# EAGLE schematic Power Board rev4 (EAGLE 8.4.1)
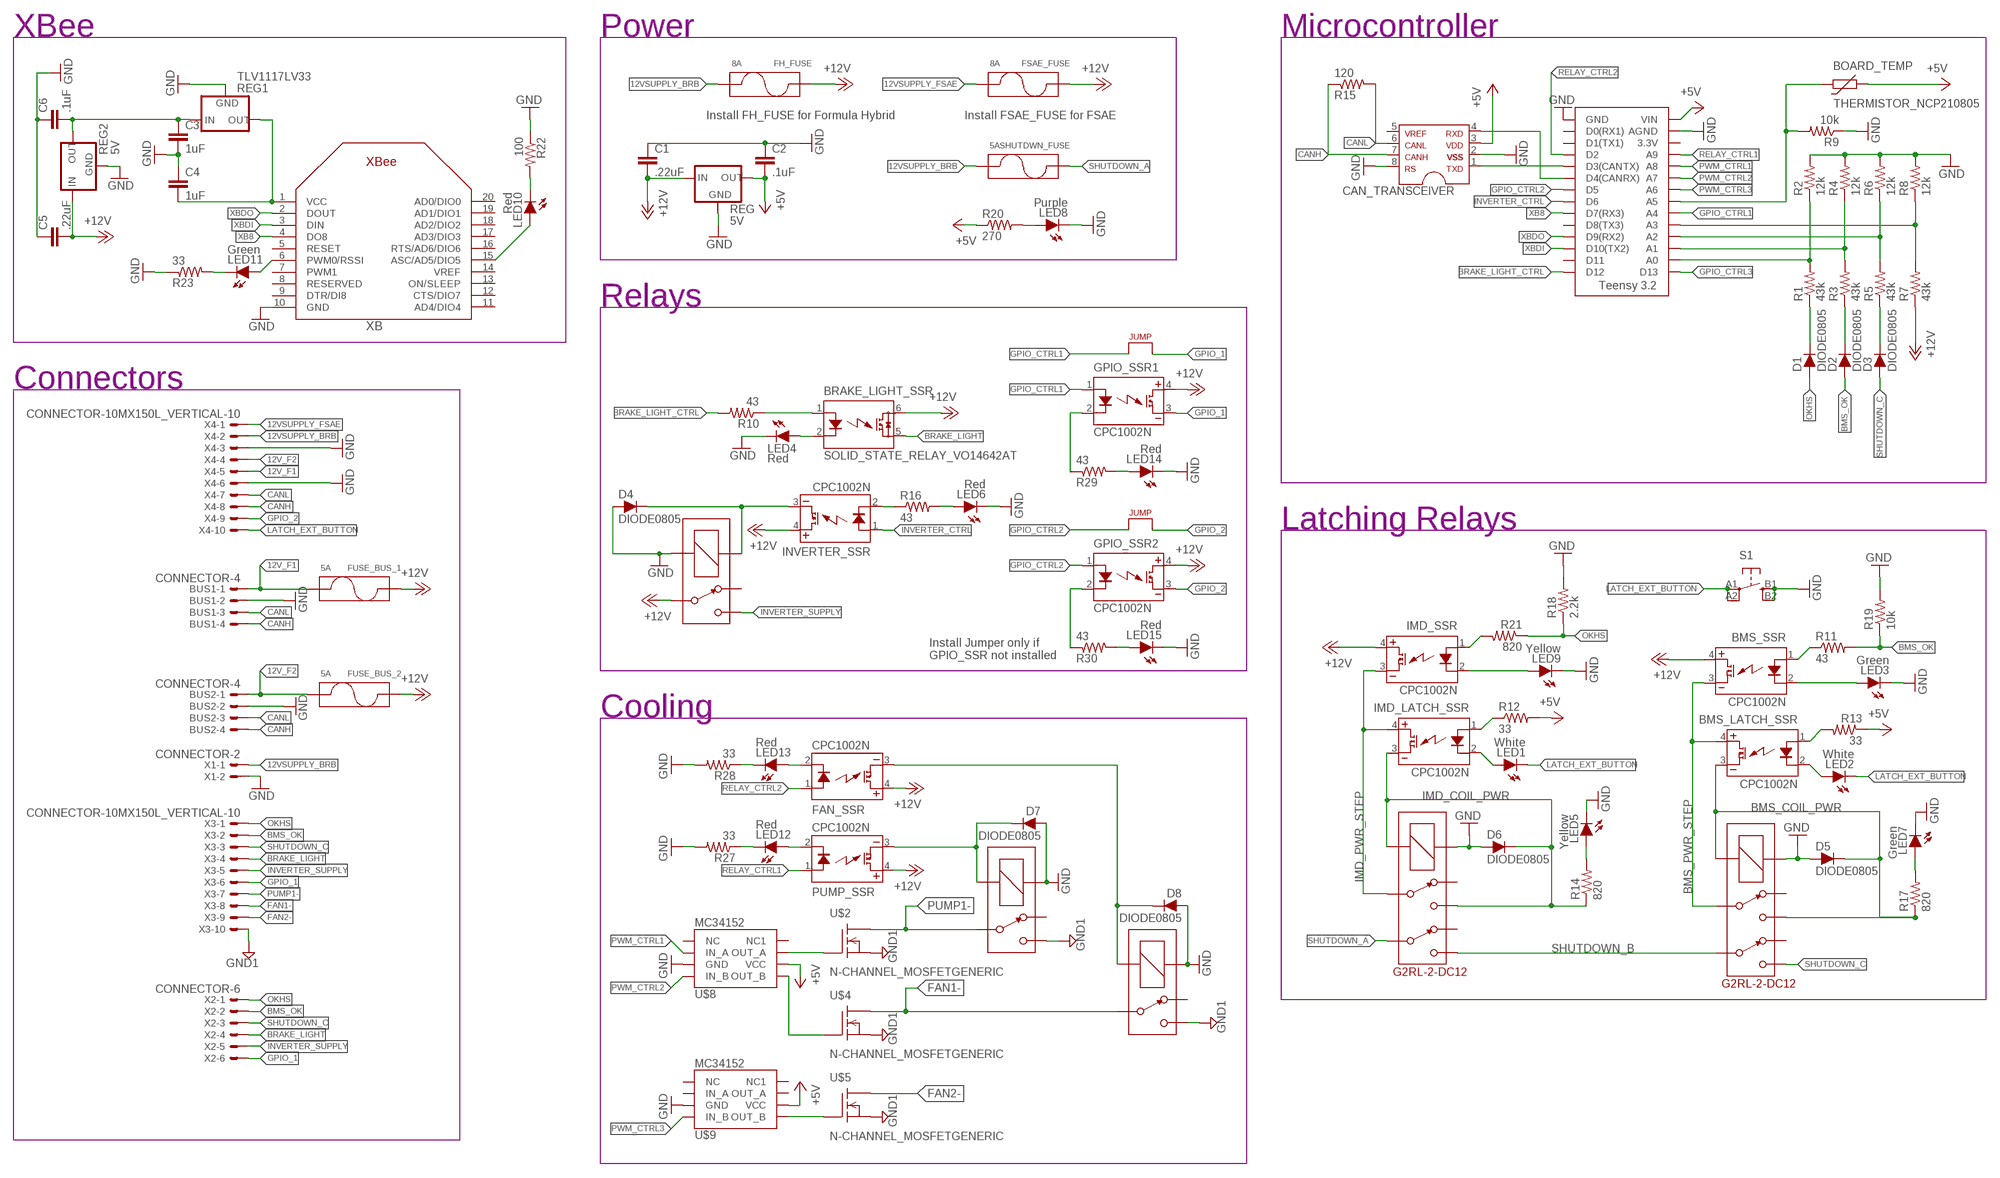
[diagram p0: schematic, sheet 1]

## Parts
BMS_LATCH_SSR  CPC1002N  [SOP04]
BMS_SSR  CPC1002N  [SOP04]
BOARD_TEMP  THERMISTOR_NCP210805  [0805]
BRAKE_LIGHT_SSR  SOLID_STATE_RELAY_VO14642AT  [DIL06]
BUS1  CONNECTOR-4  [MINIFIT_5566-4]
BUS2  CONNECTOR-4  [MINIFIT_5566-4]
C1  .22uF  CAP0805  [0805]
C2  .1uF  CAP0805  [0805]
C3  1uF  CAP0805  [0805]
C4  1uF  CAP0805  [0805]
C5  .22uF  CAP0805  [0805]
C6  .1uF  CAP0805  [0805]
CAN_TRANSCEIVER  MCP2551  [SOIC-08]
D1  DIODE0805  [0805_D]
D2  DIODE0805  [0805_D]
D3  DIODE0805  [0805_D]
D4  DIODE0805  [0805_D]
D5  DIODE0805  [0805_D]
D6  DIODE0805  [0805_D]
D7  DIODE0805  [0805_D]
D8  DIODE0805  [0805_D]
FAN_SSR  CPC1002N  [SOP04]
FH_FUSE  8A  FUSE_MINIBLADE  [MINI-BLADE_FUSE_HOLDER]
FSAE_FUSE  8A  FUSE_MINIBLADE  [MINI-BLADE_FUSE_HOLDER]
FUSE_BUS_1  5A  FUSE_MINIBLADE  [MINI-BLADE_FUSE_HOLDER]
FUSE_BUS_2  5A  FUSE_MINIBLADE  [MINI-BLADE_FUSE_HOLDER]
GPIO_SSR1  CPC1002N  [SOP04]
GPIO_SSR2  CPC1002N  [SOP04]
IMD_LATCH_SSR  CPC1002N  [SOP04]
IMD_SHUTDOWN  G2RL-2-DC12  [G2RL-2]
IMD_SHUTDOWN1  G2RL-2-DC12  [G2RL-2]
IMD_SSR  CPC1002N  [SOP04]
INVERTER_SSR  CPC1002N  [SOP04]
LED1  White  LED-0805  [LED-805]
LED2  White  LED-0805  [LED-805]
LED3  Green  LED-0805  [LED-805]
LED4  Red  LED-0805  [LED-805]
LED5  Yellow  LED-0805  [LED-805]
LED6  Red  LED-0805  [LED-805]
LED7  Green  LED-0805  [LED-805]
LED8  Purple  LED-0805  [LED-805]
LED9  Yellow  LED-0805  [LED-805]
LED10  Red  LED-0805  [LED-805]
LED11  Green  LED-0805  [LED-805]
LED12  Red  LED-0805  [LED-805]
LED13  Red  LED-0805  [LED-805]
LED14  Red  LED-0805  [LED-805]
LED15  Red  LED-0805  [LED-805]
PUMP_SSR  CPC1002N  [SOP04]
R1  43k  RESISTOR0805-RES  [0805]
R2  12k  RESISTOR0805-RES  [0805]
R3  43k  RESISTOR0805-RES  [0805]
R4  12k  RESISTOR0805-RES  [0805]
R5  43k  RESISTOR0805-RES  [0805]
R6  12k  RESISTOR0805-RES  [0805]
R7  43k  RESISTOR0805-RES  [0805]
R8  12k  RESISTOR0805-RES  [0805]
R9  10k  RESISTOR0805-RES  [0805]
R10  43  RESISTOR0805-RES  [0805]
R11  43  RESISTOR0805-RES  [0805]
R12  33  RESISTOR0805-RES  [0805]
R13  33  RESISTOR0805-RES  [0805]
R14  820  RESISTOR0805-RES  [0805]
R15  120  RESISTOR0805-RES  [0805]
R16  43  RESISTOR0805-RES  [0805]
R17  820  RESISTOR0805-RES  [0805]
R18  2.2k  RESISTOR0805-RES  [0805]
R19  10k  RESISTOR0805-RES  [0805]
R20  270  RESISTOR0805-RES  [0805]
R21  820  RESISTOR0805-RES  [0805]
R22  100  RESISTOR0805-RES  [0805]
R23  33  RESISTOR0805-RES  [0805]
R27  33  RESISTOR0805-RES  [0805]
R28  33  RESISTOR0805-RES  [0805]
R29  43  RESISTOR0805-RES  [0805]
R30  43  RESISTOR0805-RES  [0805]
REG  5V  5V_REGULATOR_LM340-NLM340MPX-5.0/NOPB  [SOT223]
REG1  TLV1117LV33  [SOT223]
REG2  5V  5V_REGULATOR_LM340-NLM340MPX-5.0/NOPB  [SOT223]
S1  BTN_10-XXSMD  [TACTILE_SWITCH_SMD_6.2MM_TALL]
SHUTDWN_FUSE  5A  FUSE_MINIBLADE  [MINI-BLADE_FUSE_HOLDER]
U$1  G5LE  [ZF112]
U$2  N-CHANNEL_MOSFETGENERIC  [TO-220-SINK]
U$3  TEENSY_3.2_SIMPLE  [TEENSY_3.2_SIMPLE]
U$4  N-CHANNEL_MOSFETGENERIC  [TO-220-SINK]
U$5  N-CHANNEL_MOSFETGENERIC  [TO-220-SINK]
U$6  G5LE  [ZF112]
U$7  G5LE  [ZF112]
U$8  MC34152  [SOIC-08]
U$9  MC34152  [SOIC-08]
U$10  JUMPER  [0805]
U$11  JUMPER  [0805]
X1  CONNECTOR-2  [MINIFIT_5566-2]
X2  CONNECTOR-6  [MINIFIT_5566-6]
X3  CONNECTOR-10MX150L_VERTICAL-10  [MX150L_VERTICAL-10]
X4  CONNECTOR-10MX150L_VERTICAL-10  [MX150L_VERTICAL-10]
XB  XBEE  [XBEE]

## Nets
12V_F1: BUS1.1 FUSE_BUS_1.R1(P2) FUSE_BUS_1.R2(P2) X4.5
12V_F2: BUS2.1 FUSE_BUS_2.R1(P2) FUSE_BUS_2.R2(P2) X4.4
12VSUPPLY_BRB: FH_FUSE.R1(P2) FH_FUSE.R2(P2) SHUTDWN_FUSE.R1(P2) SHUTDWN_FUSE.R2(P2) X1.1 X4.2
12VSUPPLY_FSAE: FSAE_FUSE.R1(P2) FSAE_FUSE.R2(P2) X4.1
12VSUPPLY_READ: R7.2 R8.1 U$3.A3
+5V: BOARD_TEMP.1 C2.2 CAN_TRANSCEIVER.3 R12.2 R13.1 R20.1 REG.3(OUT) U$3.VIN U$8.6(VCC) U$9.6(VCC)
+12V: BMS_SSR.4(DC+) BRAKE_LIGHT_SSR.6(IO1) C1.2 C5.2 FAN_SSR.4(DC+) FH_FUSE.L1(P1) FH_FUSE.L2(P1) FSAE_FUSE.L1(P1) FSAE_FUSE.L2(P1) FUSE_BUS_1.L1(P1) FUSE_BUS_1.L2(P1) FUSE_BUS_2.L1(P1) FUSE_BUS_2.L2(P1) GPIO_SSR1.4(DC+) GPIO_SSR2.4(DC+) IMD_SSR.4(DC+) INVERTER_SSR.4(DC+) PUMP_SSR.4(DC+) R7.1 REG2.1(IN) REG.1(IN) U$1.P
BMS_COIL_PWR: BMS_LATCH_SSR.3(DC-) D5.C IMD_SHUTDOWN1.4 IMD_SHUTDOWN1.COIL- R17.1
BMS_OK: D2.A R11.2 R19.1 X2.2 X3.2
BMS_OK_READ: R3.2 R4.1 U$3.A1
BMS_PWR_STEP: BMS_LATCH_SSR.4(DC+) BMS_SSR.3(DC-) IMD_SHUTDOWN1.3
BRAKE_LIGHT: BRAKE_LIGHT_SSR.5(IO2) X2.4 X3.4
BRAKE_LIGHT_CTRL: R10.2 U$3.D12
CANH: BUS1.4 BUS2.4 CAN_TRANSCEIVER.7 R15.1 X4.8
CANL: BUS1.3 BUS2.3 CAN_TRANSCEIVER.6 R15.2 X4.7
FAN1-: U$4.2(D) U$7.P X3.8
FAN2-: U$5.2(D) X3.9
GND: BUS1.2 BUS2.2 C1.1 C2.1 C3.2 C4.1 C5.1 C6.1 CAN_TRANSCEIVER.2 CAN_TRANSCEIVER.8 D4.A D5.A D6.A D7.A D8.A IMD_SHUTDOWN1.COIL+ IMD_SHUTDOWN.COIL+ LED3.C LED4.C LED5.C LED6.C LED7.C LED8.C LED9.C LED14.C LED15.C R2.2 R4.2 R6.2 R8.2 R9.1 R18.2 R19.2 R22.1 R23.1 R27.2 R28.2 REG1.1(GND) REG2.2(GND) REG2.4(GND) REG.2(GND) REG.4(GND) S1.B1(S) S1.B2(S1) U$1.2(COIL-) U$3.AGND U$3.GND U$6.1(COIL+) U$7.1(COIL+) U$8.3(GND) U$9.3(GND) X1.2 X4.3 X4.6 XB.10(GND)
GND1: U$2.3(S) U$4.3(S) U$5.3(S) U$6.S U$7.S X3.10
GPIO_1: GPIO_SSR1.3(DC-) U$10.2 X2.6 X3.6
GPIO_2: GPIO_SSR2.3(DC-) U$11.2 X4.9
GPIO_CTRL1: GPIO_SSR1.1(CONTROL+) U$3.A4 U$10.1
GPIO_CTRL2: GPIO_SSR2.1(CONTROL+) U$3.D5 U$11.1
GPIO_CTRL3: U$3.D13
IMD_COIL_PWR: D6.C IMD_LATCH_SSR.3(DC-) IMD_SHUTDOWN.4 IMD_SHUTDOWN.COIL- R14.1
IMD_PWR_STEP: IMD_LATCH_SSR.4(DC+) IMD_SHUTDOWN.3 IMD_SSR.3(DC-)
INVERTER_CTRL: INVERTER_SSR.1(CONTROL+) U$3.D6
INVERTER_SUPPLY: U$1.S X2.5 X3.5
LATCH_EXT_BUTTON: LED1.C LED2.C S1.A1(P) S1.A2(P1) X4.10
N$1: IMD_LATCH_SSR.2(CONTROL-) LED1.A
N$2: CAN_TRANSCEIVER.4 U$3.D4(CANRX)
N$3: CAN_TRANSCEIVER.1 U$3.D3(CANTX)
N$4: D7.C PUMP_SSR.3(DC-) U$6.2(COIL-)
N$5: IMD_LATCH_SSR.1(CONTROL+) R12.1
N$6: GPIO_SSR1.2(CONTROL-) R29.1
N$7: BRAKE_LIGHT_SSR.2(LED-) LED4.A
N$8: GPIO_SSR2.2(CONTROL-) R30.1
N$9: BMS_SSR.2(CONTROL-) LED3.A
N$10: LED10.A XB.15(ASC/AD5/DIO5)
N$11: LED10.C R22.2
N$12: BMS_LATCH_SSR.1(CONTROL+) R13.2
N$13: LED14.A R29.2
N$14: LED15.A R30.2
N$15: BOARD_TEMP.2 R9.2 U$3.A5
N$16: BMS_LATCH_SSR.2(CONTROL-) LED2.A
N$17: BRAKE_LIGHT_SSR.1(LED+) R10.1
N$18: BMS_SSR.1(CONTROL+) R11.1
N$19: LED5.A R14.2
N$20: D8.C FAN_SSR.3(DC-) U$7.2(COIL-)
N$22: D1.C R1.1
N$23: D2.C R3.1
N$24: D3.C R5.1
N$25: LED11.A XB.6(PWM0/RSSI)
N$26: D4.C INVERTER_SSR.3(DC-) U$1.1(COIL+)
N$27: INVERTER_SSR.2(CONTROL-) R16.1
N$28: LED6.A R16.2
N$29: LED8.A R20.2
N$31: IMD_SSR.1(CONTROL+) R21.2
N$32: LED7.A R17.2
N$33: LED11.C R23.2
N$34: IMD_SSR.2(CONTROL-) LED9.A
N$35: C3.1 C6.2 REG1.3(IN) REG2.3(OUT)
N$36: LED13.C R28.1
N$37: LED12.C R27.1
N$38: LED12.A PUMP_SSR.2(CONTROL-)
N$39: U$2.1(G) U$8.7(OUT_A)
N$40: U$4.1(G) U$8.5(OUT_B)
N$41: U$5.1(G) U$9.5(OUT_B)
N$42: FAN_SSR.2(CONTROL-) LED13.A
OKHS: D1.A R18.1 R21.1 X2.1 X3.1
OKHS_READ: R1.2 R2.1 U$3.A0
PUMP1-: U$2.2(D) U$6.P X3.7
PWM_CTRL1: U$3.A8 U$8.2(IN_A)
PWM_CTRL2: U$3.A7 U$8.4(IN_B)
PWM_CTRL3: U$3.A6 U$9.4(IN_B)
RELAY_CTRL1: PUMP_SSR.1(CONTROL+) U$3.A9
RELAY_CTRL2: FAN_SSR.1(CONTROL+) U$3.D2
SHUTDOWN_A: IMD_SHUTDOWN.6 SHUTDWN_FUSE.L1(P1) SHUTDWN_FUSE.L2(P1)
SHUTDOWN_B: IMD_SHUTDOWN1.6 IMD_SHUTDOWN.5
SHUTDOWN_C: D3.A IMD_SHUTDOWN1.5 X2.3 X3.3
SHUTDOWN_OUT_READ: R5.2 R6.1 U$3.A2
VCC: C4.2 REG1.2(OUT) REG1.4(OUT) XB.1(VCC)
XB8: U$3.D7(RX3) XB.4(DO8)
XBDI: U$3.D10(TX2) XB.3(DIN)
XBDO: U$3.D9(RX2) XB.2(DOUT)
Unconnected: CAN_TRANSCEIVER.5 IMD_SHUTDOWN1.2 IMD_SHUTDOWN1.7 IMD_SHUTDOWN.2 IMD_SHUTDOWN.7 U$1.O U$3.3.3V U$3.D0(RX1) U$3.D1(TX1) U$3.D8(TX3) U$3.D11 U$6.O U$7.O U$8.1(NC) U$8.8(NC1) U$9.1(NC) U$9.2(IN_A) U$9.7(OUT_A) U$9.8(NC1) XB.5(RESET) XB.7(PWM1) XB.8(RESERVED) XB.9(DTR/DI8) XB.11(AD4/DIO4) XB.12(CTS/DIO7) XB.13(ON/SLEEP) XB.14(VREF) XB.16(RTS/AD6/DIO6) XB.17(AD3/DIO3) XB.18(AD2/DIO2) XB.19(AD1/DIO1) XB.20(AD0/DIO0)

## Notes on the sheet
- XBee | Power | Microcontroller
- Install FH_FUSE for Formula Hybrid | Install FSAE_FUSE for FSAE
- Relays
- Connectors
- Latching Relays
- Install Jumper only if
  GPIO_SSR not installed
- Cooling

## Library data of the parts
BMS_LATCH_SSR BMS_SSR FAN_SSR GPIO_SSR1 GPIO_SSR2 IMD_LATCH_SSR IMD_SSR INVERTER_SSR PUMP_SSR = HyTechDevices:CPC1002N: IXYS Solid State Relay .7A
BOARD_TEMP = HyTechDevices:THERMISTOR_NCP21: Murata NCP Thermistor Datasheet <http://www.murata.com/~/media/webrenewal/support/library/catalog/products/thermistor/ntc/r44e.ashx>
BRAKE_LIGHT_SSR = HyTechDevices:SOLID_STATE_RELAY
BUS1 BUS2 = HyTechDevices:CONNECTOR-4: Mini-Fit Junior connector 4 pole Source: http://www.molex.com; OC_FARNELL: unknown; OC_NEWARK: unknown
C1-C6 = HyTechDevices:CAP: Capacitor Standard 0603 ceramic capacitor, and 0.1" leaded capacitor.
CAN_TRANSCEIVER = HyTechDevices:MCP2551: MCP2551 High-Speed CAN Transceiver Product Webpage <https://www.microchip.com/wwwproducts/en/MCP2551> Datasheet <http://ww1.microchip.com/downloads/en/DeviceDoc/21667f.pdf> This device is outdated It is replaced by MCP2561. Comparison Page <https://www.microchip.com/wwwproducts/ProductCompare/MCP2551/MCP2561> Product Webpage <https://www.microchip.com/wwwproducts/en/MCP2561> Datasheet <http://ww1.microchip.com/downloads/en/DeviceDoc/20005167C.pdf>
D1-D8 = HyTechDevices:DIODE: DIODE general purpose rectifier
FH_FUSE FSAE_FUSE FUSE_BUS_1 FUSE_BUS_2 SHUTDWN_FUSE = HyTechDevices:FUSE: Fuse/Fuseclips Keystone Electronics 3568 Fuse Mouser Part <http://www.mouser.com/ProductDetail/Keystone-Electronics/3568> Datasheet <http://www.mouser.com/ds/2/215/568-742601.pdf> Bussman/Eaton Midget Fuse Clip 1A3400 <http://www.mouser.com/ProductDetail/Bussmann-Eaton/BK-1A3400-09-R/?qs=sGAEpiMZZMuG%252bgnN5hGYGzzlAelq2OxnKqVSMVjq8I4%3d> Schurter 0751.0110 Brass Fuse Clip Datasheet <http://www.mouser.com/ds/2/358/typ_OG__Clip__5x20-2553.pdf>
IMD_SHUTDOWN IMD_SHUTDOWN1 = HyTechDevices:G2RL-2-DC12: Omron G2RL-2 Double Pull Double Throw Relay Coil Voltage: 12VDC (8.4-18VDC @60ºC) Contact Amperage: 8A at 30VDC Datasheet <https://www.omron.com/ecb/products/pdf/en-g2rl.pdf>
LED1-LED15 = HyTechDevices:LED: Light Emitting Diode (LED) Source: Dangerous Prototypes Eagle Library <https://github.com/DangerousPrototypes/Eagle_Part_Library>
R1-R23 R27-R30 = HyTechDevices:RESISTOR: Resistor Basic schematic elements and footprints for 0603, 1206, and PTH resistors.
REG REG2 = HyTechDevices:5V_REGULATOR_LM340-N: Voltage Regulator 5v linear voltage regulator Datasheet <http://www.mouser.com/ProductDetail/Texas-Instruments/LM340MPX-50-NOPB/?qs=X1J7HmVL2ZGZwtTFRQ9ItA%3D%3D> MAX current out: 1.5A MAX voltage in: 35V
REG1 = HyTechDevices:TLV1117LV33: Texas Instruments TLV1117LV33 3.3V Linear Regulator
S1 = HyTechDevices:BTN_10-XX: Small momentary tactile push button
U$1 U$6 U$7 = HyTechDevices:G5LE: Omron G5LE SPST Relay 5 VDC, 12VDC, 24VDC models Coil voltage: 75% - 170% of nominal voltage Datasheet <https://www.omron.com/ecb/products/pdf/en-g5le.pdf>
U$2 U$4 U$5 = HyTechDevices:N-CHANNEL_MOSFET: Generic N-Channel MOSFET; _EXTERNAL_: 1
U$3 = HyTechDevices:TEENSY_3.2_SIMPLE: Simple version of the Teensy 3.2 board that only uses the 2 main rows of pins, not the inner pins or the pins opposite the usb port.
U$8 U$9 = HyTechDevices:MC34152: Microchip MC34152 High Speed Dual MOSFET Driver
U$10 U$11 = HyTechDevices:JUMPER: Jumper for changing operation of a device
X1 = HyTechDevices:CONNECTOR-2: Mini-Fit Junior connector 2 pole Source: http://www.molex.com; OC_FARNELL: 1822072; OC_NEWARK: unknown
X2 = HyTechDevices:CONNECTOR-6: Mini-Fit Junior connector 6 pole Source: http://www.molex.com; MPN: 95566-61002; OC_FARNELL: unknown; OC_NEWARK: 22K8620
X3 X4 = HyTechDevices:CONNECTOR-10: Mini-Fit Junior connector 10 pole Source: http://www.molex.com
XB = HyTechDevices:XBEE: Source: Adafruit <https://github.com/adafruit/Adafruit-Eagle-Library>